# Altium schematic sheet RELAY5.SchDoc
size A
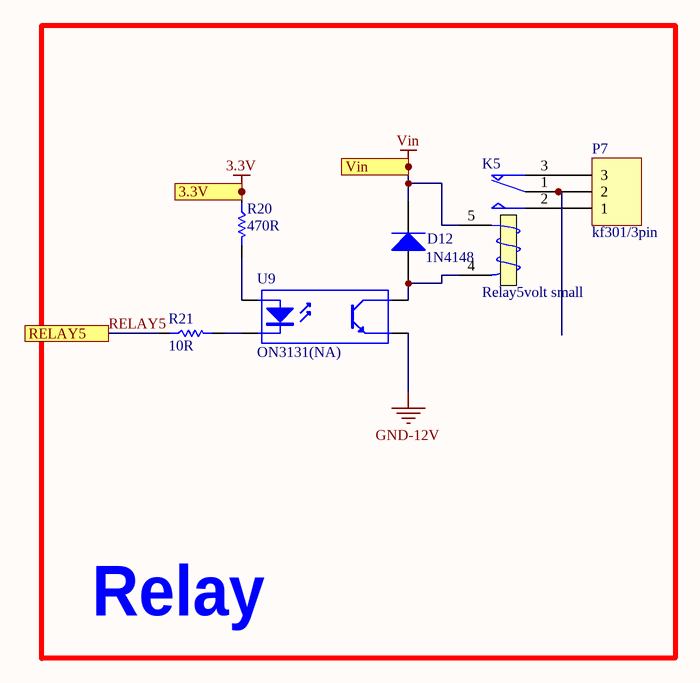
[diagram p0: RELAY5.SchDoc]

## Parts
D12  1N4148  [sod123]
K5  Relay5volt small  [relay5_childern]
P7  kf301/3pin  [Blue Connector 1*3 -kf301]
R20  470R  [0805/resistor]
R21  10R  [0805/resistor]
U9  ON3131(NA)  [OPTO_COUPLER]

## Blocks framed on the sheet
Relay: D12 K5 P7 R20 R21 U9

## Ports
3.3V, RELAY5, Vin

## Nets
3.3V: R20.1 ; port 3.3V
GND-12V: U9.3(E)
Vin: D12.K K5.5 ; port Vin
RELAY5: R21.1 ; port RELAY5
NetD12_A: D12.A K5.4(T2) U9.4(C)
NetK5_1: K5.1(COM) P7.2
NetK5_2: K5.2(NO) P7.1
NetK5_3: K5.3(T1) P7.3
NetR20_2: R20.2 U9.1(A)
NetR21_2: R21.2 U9.2(K)

## Library data of the parts
D12 = Diode 1N4007: 1 Amp General Purpose Rectifier; Published: 8-Jun-2000; LatestRevisionDate: 17-Jul-2002; LatestRevisionNote: Re-released for DXP Platform.; DatasheetVersion: 1998; PackageVersion: Aug-1999; PackageReference: DO-41; Publisher: Altium Limited; PackageDescription: Diode, Axial; Body 5.2 x 2.7 mm (LxDia. max), Lead Dia. 0.86 mm (max); Code_JEDEC: DO-204-AL; ComponentLink1Description: Manufacturer Link; ComponentLink1URL: http://www.fairchildsemi.com/; ComponentLink2Description: Datasheet; ComponentLink2URL: http://www.fairchildsemi.com/ds/1N%2F1N4001.pdf
K5 = Relay: SPDT Relay; Published: 8-Jun-2000; LatestRevisionDate: 17-Jul-2002; LatestRevisionNote: Re-released for DXP Platform.; PackageReference: MODULE5B; Publisher: Altium Limited
P7 = Header 3: LatestRevisionDate: 17-Jul-2002; LatestRevisionNote: Re-released for DXP Platform.; Publisher: Altium Limited
R20 R21 = Resistor: Tolerance: 5%; Power: 1/8 W
  R20: Value: 470R
  R21: Value: 10R
U9 = Optoisolator1: 4-Pin Phototransistor Optocoupler; Published: 24-Mar-1999; LatestRevisionDate: 04-Mar-2005; LatestRevisionNote: Sch pins 3 & 4 Swapped.; DatasheetVersion: Nov-2003; PackageReference: DIP-4; Publisher: Altium Limited